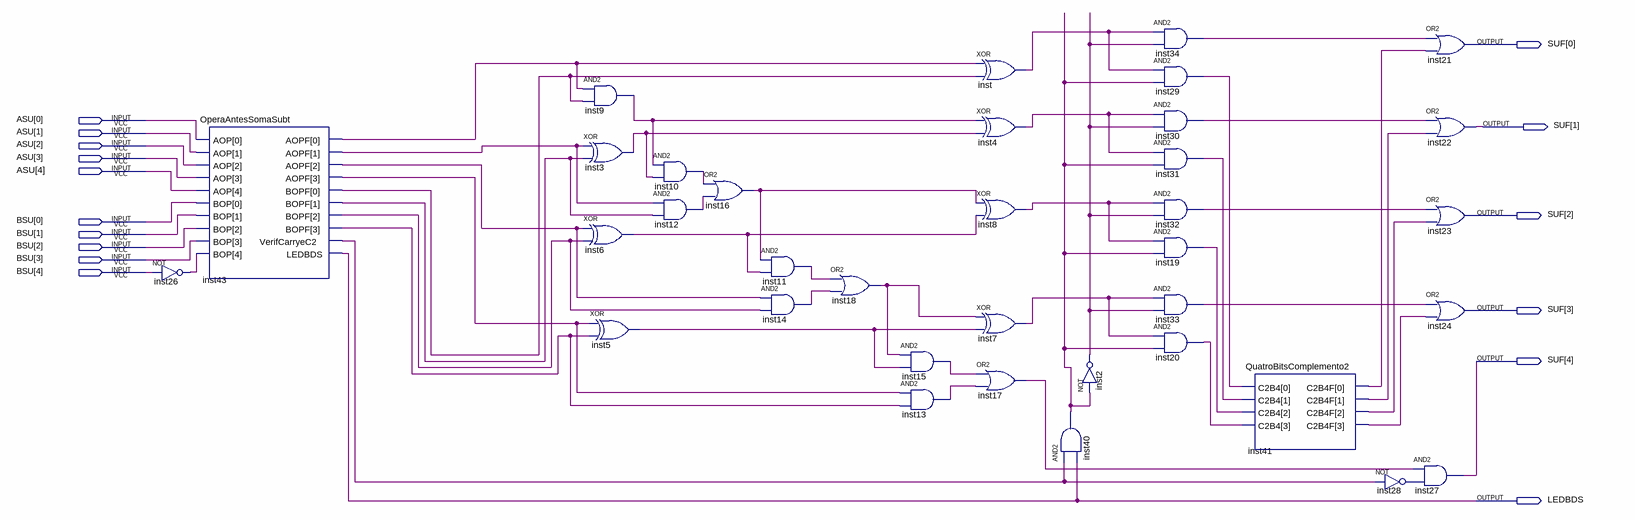
[diagram p0: schematic sheet]
// Quartus schematic Subtrator.bdf as structural Verilog: 36 symbols, 16 pins
module Subtrator (
  input  [4:0] ASU,
  input  [4:0] BSU,
  output [4:0] SUF,
  output LEDBDS
);

  wire inst2_out, inst3_out, inst4_out, inst5_out, inst6_out, inst7_out, inst8_out, inst9_out, inst10_out,
       inst11_out, inst12_out, inst13_out, inst14_out, inst15_out, inst16_out, inst17_out, inst18_out,
       inst19_out, inst20_out, inst26_out, inst28_out, inst29_out, inst30_out, inst31_out, inst32_out,
       inst33_out, inst34_out, inst40_out, inst41_c2b4f, inst41_c2b4f_2, inst41_c2b4f_3, inst41_c2b4f_4,
       inst43_aopf, inst43_aopf_2, inst43_aopf_3, inst43_aopf_4, inst43_bopf, inst43_bopf_2, inst43_bopf_3,
       inst43_bopf_4, inst43_verifcarryec2, inst_out;

  not inst26 (inst26_out, BSU[4]);
  OperaAntesSomaSubt inst43 (
    .AOP(ASU), .BOP({inst26_out, BSU[3:0]}),
    .AOPF({inst43_aopf_4, inst43_aopf_3, inst43_aopf, inst43_aopf_2}),
    .BOPF({inst43_bopf_2, inst43_bopf, inst43_bopf_3, inst43_bopf_4}), .VerifCarryeC2(inst43_verifcarryec2),
    .LEDBDS(LEDBDS));
  and inst9 (inst9_out, inst43_aopf_2, inst43_bopf_4);
  xor inst3 (inst3_out, inst43_aopf, inst43_bopf_3);
  xor inst6 (inst6_out, inst43_aopf_3, inst43_bopf);
  xor inst5 (inst5_out, inst43_aopf_4, inst43_bopf_2);
  and inst10 (inst10_out, inst9_out, inst3_out);
  and inst12 (inst12_out, inst43_aopf, inst43_bopf_3);
  or inst16 (inst16_out, inst10_out, inst12_out);
  and inst11 (inst11_out, inst16_out, inst6_out);
  and inst14 (inst14_out, inst43_aopf_3, inst43_bopf);
  or inst18 (inst18_out, inst11_out, inst14_out);
  and inst15 (inst15_out, inst18_out, inst5_out);
  and inst13 (inst13_out, inst43_aopf_4, inst43_bopf_2);
  xor inst (inst_out, inst43_aopf_2, inst43_bopf_4);
  xor inst4 (inst4_out, inst9_out, inst3_out);
  xor inst8 (inst8_out, inst16_out, inst6_out);
  xor inst7 (inst7_out, inst18_out, inst5_out);
  or inst17 (inst17_out, inst15_out, inst13_out);
  and inst40 (inst40_out, inst43_verifcarryec2, LEDBDS);
  not inst2 (inst2_out, inst40_out);
  and inst34 (inst34_out, inst_out, inst2_out);
  and inst29 (inst29_out, inst_out, inst40_out);
  and inst30 (inst30_out, inst4_out, inst2_out);
  and inst31 (inst31_out, inst4_out, inst40_out);
  and inst32 (inst32_out, inst8_out, inst2_out);
  and inst19 (inst19_out, inst8_out, inst40_out);
  and inst33 (inst33_out, inst7_out, inst2_out);
  and inst20 (inst20_out, inst7_out, inst40_out);
  QuatroBitsComplemento2 inst41 (
    .C2B4({inst20_out, inst19_out, inst31_out, inst29_out}),
    .C2B4F({inst41_c2b4f_4, inst41_c2b4f_3, inst41_c2b4f, inst41_c2b4f_2}));
  not inst28 (inst28_out, inst43_verifcarryec2);
  or inst21 (SUF[0], inst34_out, inst41_c2b4f_2);
  or inst22 (SUF[1], inst30_out, inst41_c2b4f);
  or inst23 (SUF[2], inst32_out, inst41_c2b4f_3);
  or inst24 (SUF[3], inst33_out, inst41_c2b4f_4);
  and inst27 (SUF[4], inst17_out, inst28_out);
endmodule
